# Altium schematic sheet 3Dheater2.SchDoc
size A4
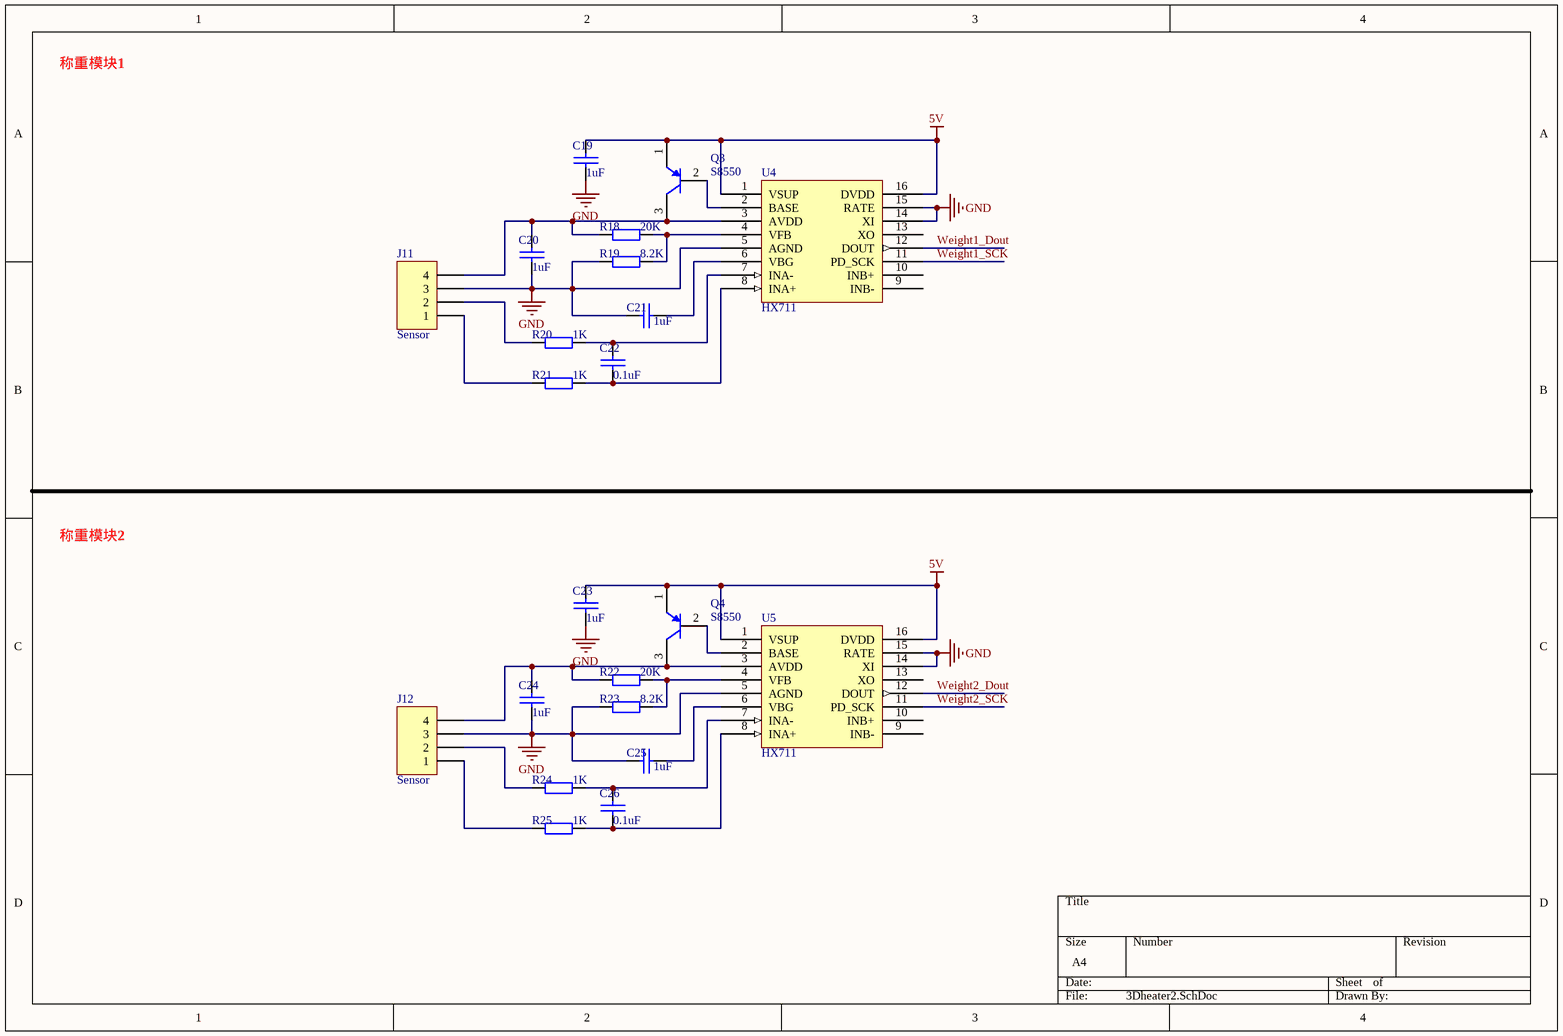
[diagram p0: 3Dheater2.SchDoc]

## Parts
C19  1uF  [C0805]
C20  1uF  [C0805]
C21  1uF  [C0805]
C22  0.1uF  [C0805]
C23  1uF  [C0805]
C24  1uF  [C0805]
C25  1uF  [C0805]
C26  0.1uF  [C0805]
J11  Sensor  [HDR1X4]
J12  Sensor  [HDR1X4]
Q3  S8550  [SOT-23-3L]
Q4  S8550  [SOT-23-3L]
R18  20K  [R0805]
R19  8.2K  [R0805]
R20  1K  [R0805]
R21  1K  [R0805]
R22  20K  [R0805]
R23  8.2K  [R0805]
R24  1K  [R0805]
R25  1K  [R0805]
U4  HX711  [SOP16M]
U5  HX711  [SOP16M]

## Nets
5V: C19.1 C23.1 Q3.1(E) Q4.1(E) U4.1(VSUP) U4.16(DVDD) U5.1(VSUP) U5.16(DVDD)
GND: C19.2 C20.1 C21.2 C23.2 C24.1 C25.2 J11.3 J12.3 R19.2 R23.2 U4.5(AGND) U4.14(XI) U4.15(RATE) U5.5(AGND) U5.14(XI) U5.15(RATE)
Weight1_Dout: U4.12(DOUT)
Weight1_SCK: U4.11(PD_SCK)
Weight2_Dout: U5.12(DOUT)
Weight2_SCK: U5.11(PD_SCK)
NetC20_2: C20.2 J11.4 Q3.3(C) R18.2 U4.3(AVDD)
NetC21_1: C21.1 U4.6(VBG)
NetC22_1: C22.1 R21.1 U4.8(INA+)
NetC22_2: C22.2 R20.1 U4.7(INA-)
NetC24_2: C24.2 J12.4 Q4.3(C) R22.2 U5.3(AVDD)
NetC25_1: C25.1 U5.6(VBG)
NetC26_1: C26.1 R25.1 U5.8(INA+)
NetC26_2: C26.2 R24.1 U5.7(INA-)
NetJ11_1: J11.1 R21.2
NetJ11_2: J11.2 R20.2
NetJ12_1: J12.1 R25.2
NetJ12_2: J12.2 R24.2
NetQ3_2: Q3.2(B) U4.2(BASE)
NetQ4_2: Q4.2(B) U5.2(BASE)
NetR18_1: R18.1 R19.1 U4.4(VFB)
NetR22_1: R22.1 R23.1 U5.4(VFB)

Not connected (* = marked no-connect by the designer): U4 9(INB-) 10(INB+) 13(XO); U5 9(INB-) 10(INB+) 13(XO)

## Notes on the sheet
- 称重模块1
- 称重模块2

## Library data of the parts
C19-C26 = CAP: Capacitor
J11 J12 = Header 4: Header, 4-Pin; LatestRevisionDate: 17-Jul-2002; LatestRevisionNote: Re-released for DXP Platform.; Publisher: Altium Limited
Q3 Q4 = S8550: PNP三极管; Published: 8-Jun-2000; LatestRevisionDate: 15-Jan-2003; LatestRevisionNote: PCB Footprint 'BCY-W3/D4.7' replaced; DatasheetDocument: 1997; PackageDocument: Sep-1998; PackageReference: TO-92A; Publisher: Altium Limited; Code_JEDEC: TO-92A; ComponentLink1Description: Manufacturer Link; ComponentLink1URL: http://www.fairchildsemi.com/; ComponentLink2Description: Datasheet; ComponentLink2URL: http://www.fairchildsemi.com/ds/2N%2F2N3906.pdf
R18-R25 = Res1: 贴片电阻; Published: 8-Jun-2000; LatestRevisionDate: 17-Jul-2002; LatestRevisionNote: Re-released for DXP Platform.; PackageReference: AXIAL-0.4; Publisher: Altium Limited
  R18 R22: Value: 20K
  R19 R23: Value: 8.2K
  R20 R21 R24 R25: Value: 1K
U4 U5 = HX711: AD转换